# EAGLE schematic ATmega128RFA1-DevBoard (EAGLE 7.5.0)
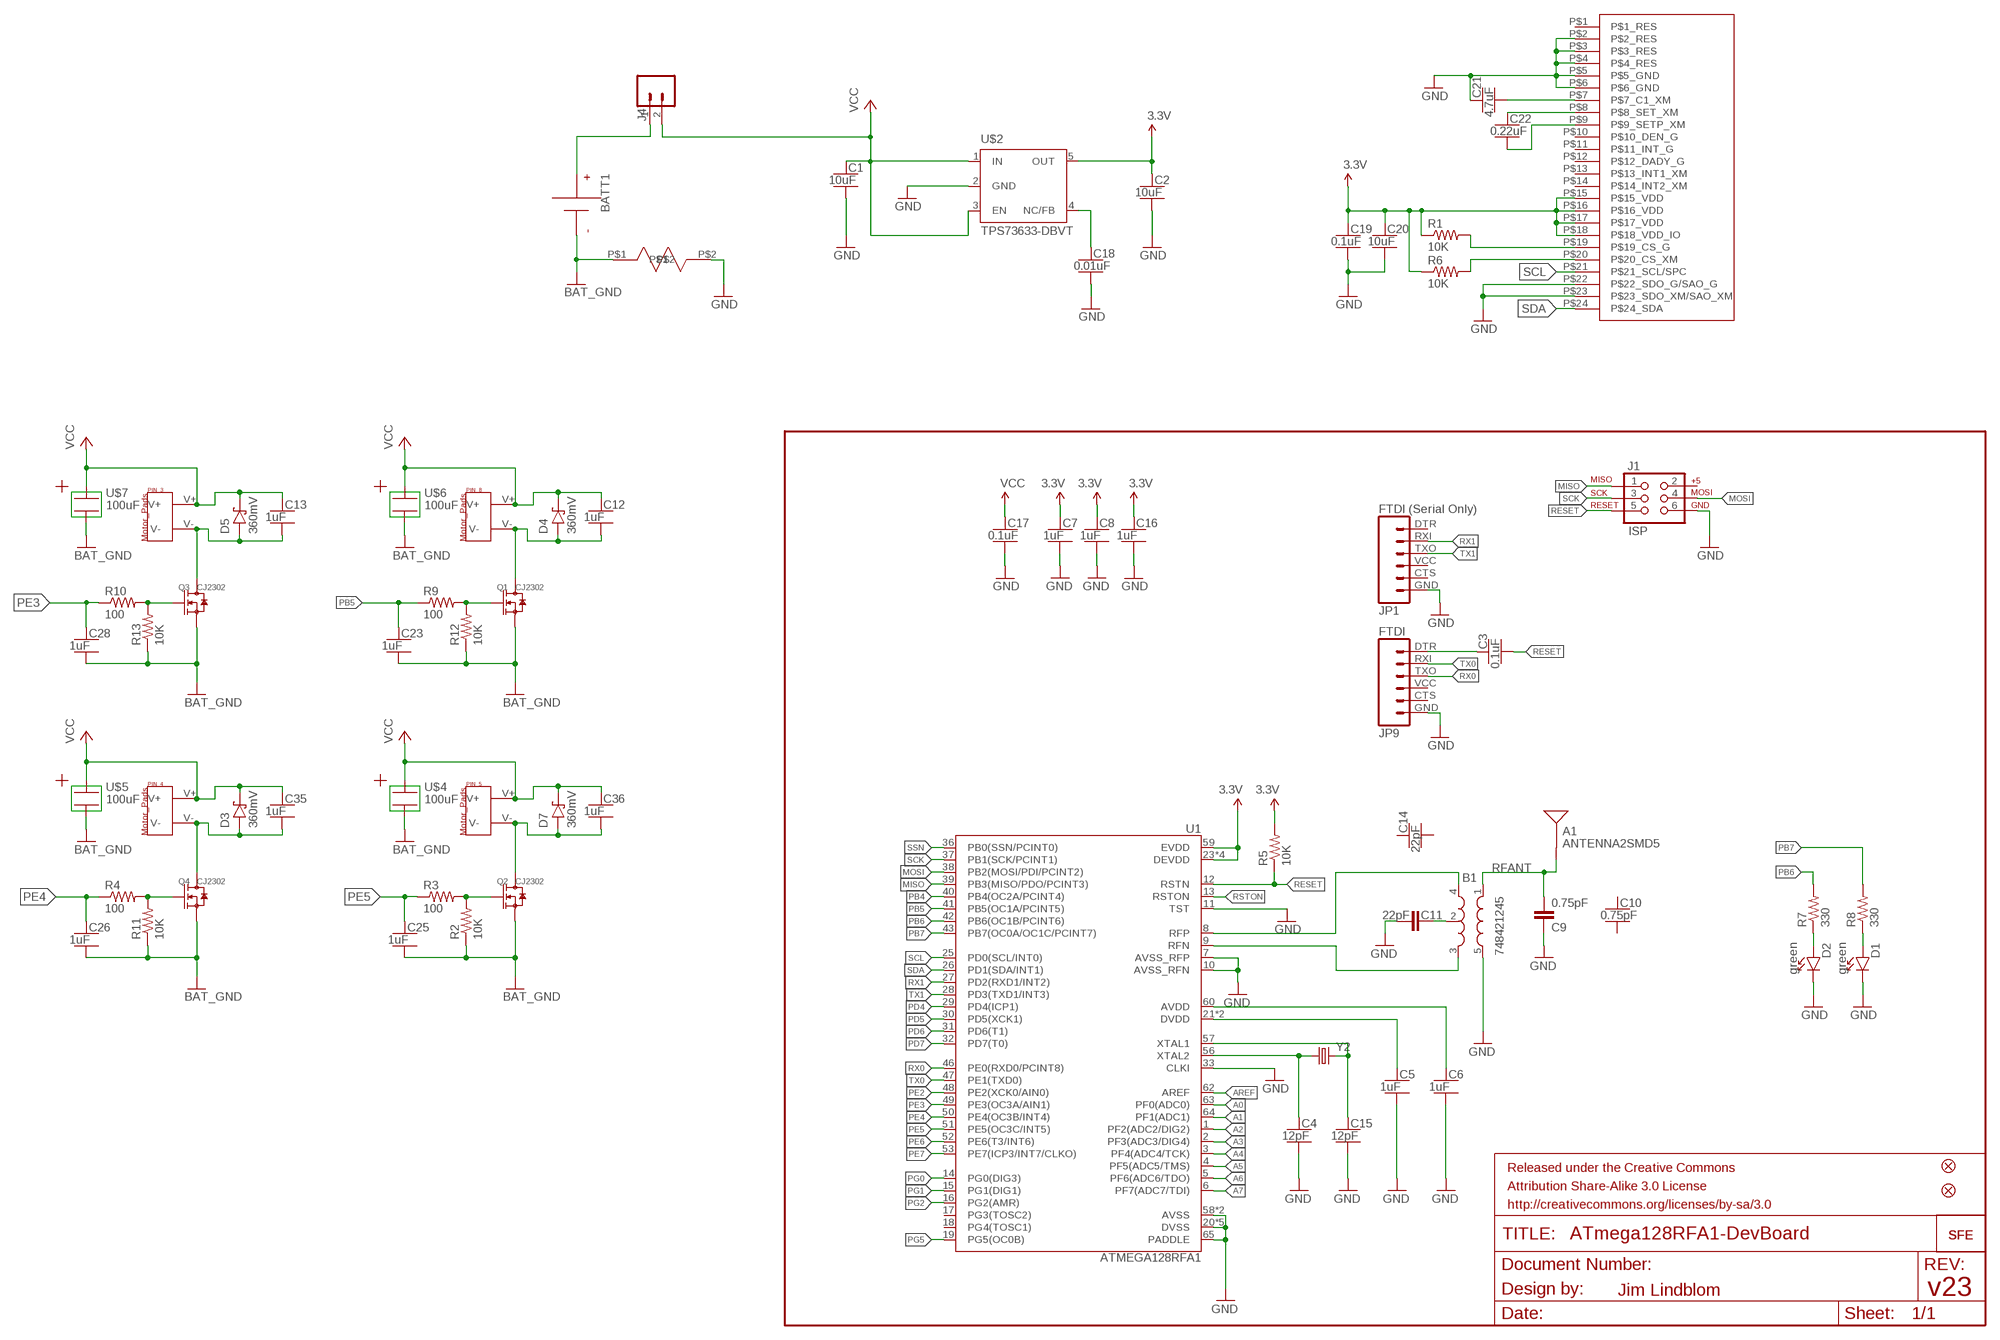
[diagram p0: schematic, sheet 1]

## Parts
A1  ANTENNA2SMD5  [ANTENNA-CHIP5]
B1  748421245  BALUN0805  [BALUN]
BATT1  BATTERY-HUBSAN-W/HOLDER  [BATTERY-W/HOLDER-380MAH-HUBSAN]
C1  10uF  CAPACITOR-NP_SMD-2012-0805_CERAMIC-10UF  [CAPC2012X140_HS]
C2  10uF  CAPACITOR-NP_SMD-2012-0805_CERAMIC-10UF  [CAPC2012X140_HS]
C3  0.1uF  CAPACITOR-NP_SMD-2012-0805_CERAMIC-0.1UF  [CAPC2012X140_HS]
C4  12pF  CAPACITOR-NP_SMD-2012-0805_CERAMIC-12PF  [CAPC2012X140_HS]
C5  1uF  CAPACITOR-NP_SMD-2012-0805_CERAMIC-1UF  [CAPC2012X140_HS]
C6  1uF  CAPACITOR-NP_SMD-2012-0805_CERAMIC-1UF  [CAPC2012X140_HS]
C7  1uF  CAPACITOR-NP_SMD-2012-0805_CERAMIC-1UF  [CAPC2012X140_HS]
C8  1uF  CAPACITOR-NP_SMD-2012-0805_CERAMIC-1UF  [CAPC2012X140_HS]
C9  0.75pF  CAP0402-CAP  [0402-CAP]
C10  0.75pF  CAPACITOR-NP_SMD-2012-0805_CERAMIC-0.75PF  [CAPC2012X140_HS]
C11  22pF  CAP0402-CAP  [0402-CAP]
C12  1uF  CAPACITOR-NP_SMD-2012-0805_CERAMIC-1UF  [CAPC2012X140_HS]
C13  1uF  CAPACITOR-NP_SMD-2012-0805_CERAMIC-1UF  [CAPC2012X140_HS]
C14  22pF  CAPACITOR-NP_SMD-2012-0805_CERAMIC-22PF  [CAPC2012X140_HS]
C15  12pF  CAPACITOR-NP_SMD-2012-0805_CERAMIC-12PF  [CAPC2012X140_HS]
C16  1uF  CAPACITOR-NP_SMD-2012-0805_CERAMIC-1UF  [CAPC2012X140_HS]
C17  0.1uF  CAPACITOR-NP_SMD-2012-0805_CERAMIC-0.1UF  [CAPC2012X140_HS]
C18  0.01uF  CAPACITOR-NP_SMD-2012-0805_CERAMIC-0.01UF  [CAPC2012X140_HS]
C19  0.1uF  CAPACITOR-NP_SMD-2012-0805_CERAMIC-0.1UF  [CAPC2012X140_HS]
C20  10uF  CAPACITOR-NP_SMD-2012-0805_CERAMIC-10UF  [CAPC2012X140_HS]
C21  4.7uF  CAPACITOR-NP_SMD-2012-0805_CERAMIC-4.7UF  [CAPC2012X140_HS]
C22  0.22uF  CAPACITOR-NP_SMD-2012-0805_CERAMIC-0.22UF  [CAPC2012X140_HS]
C23  1uF  CAPACITOR-NP_SMD-2012-0805_CERAMIC-1UF  [CAPC2012X140_HS]
C25  1uF  CAPACITOR-NP_SMD-2012-0805_CERAMIC-1UF  [CAPC2012X140_HS]
C26  1uF  CAPACITOR-NP_SMD-2012-0805_CERAMIC-1UF  [CAPC2012X140_HS]
C28  1uF  CAPACITOR-NP_SMD-2012-0805_CERAMIC-1UF  [CAPC2012X140_HS]
C35  1uF  CAPACITOR-NP_SMD-2012-0805_CERAMIC-1UF  [CAPC2012X140_HS]
C36  1uF  CAPACITOR-NP_SMD-2012-0805_CERAMIC-1UF  [CAPC2012X140_HS]
D1  green  DIODE-LED_SMD-2012-0805-GREEN  [LEDSC125X200X120-2_HS]
D2  green  DIODE-LED_SMD-2012-0805-GREEN  [LEDSC125X200X120-2_HS]
D3  360mV  DIODE-SCHOTTKY_SMD-SOD123-360MV  [SOD3716X135_HS]
D4  360mV  DIODE-SCHOTTKY_SMD-SOD123-360MV  [SOD3716X135_HS]
D5  360mV  DIODE-SCHOTTKY_SMD-SOD123-360MV  [SOD3716X135_HS]
D7  360mV  DIODE-SCHOTTKY_SMD-SOD123-360MV  [SOD3716X135_HS]
FID1  FIDUCIALUFIDUCIAL  [MICRO-FIDUCIAL]
FID2  FIDUCIALUFIDUCIAL  [MICRO-FIDUCIAL]
J1  ISP  AVR_SPI_PRG_6NS  [2X3-NS]
J4  MALE_HEADER_2POS-2X1-0.1IN  [MALE_HEADER_2X1_0.1IN]
JP1  FTDI (Serial Only)  FTDI_BASICPTH  [FTDI_BASIC]
JP4  LOGO-SFENEW  [SFE-NEW-WEBLOGO]
JP9  FTDI  FTDI_BASICPTH  [FTDI_BASIC]
JP10  LOGO-SFENEW  [SFE-NEW-WEBLOGO]
PIN_3  MOTOR_PADS  [MOTOR_PADS]
PIN_4  MOTOR_PADS  [MOTOR_PADS]
PIN_5  MOTOR_PADS  [MOTOR_PADS]
PIN_8  MOTOR_PADS  [MOTOR_PADS]
Q1  CJ2302  SMD-MOSFET-N-CH-20V-2.1A-CJ2302(SOT-23)  [SOT-23]
Q2  CJ2302  SMD-MOSFET-N-CH-20V-2.1A-CJ2302(SOT-23)  [SOT-23]
Q3  CJ2302  SMD-MOSFET-N-CH-20V-2.1A-CJ2302(SOT-23)  [SOT-23]
Q4  CJ2302  SMD-MOSFET-N-CH-20V-2.1A-CJ2302(SOT-23)  [SOT-23]
R1  10K  RESISTOR_SMD-2012-0805-10K  [RESC2012X60_HS]
R2  10K  RESISTOR_SMD-2012-0805-10K  [RESC2012X60_HS]
R3  100  RESISTOR_SMD-2012-0805-100  [RESC2012X60_HS]
R4  100  RESISTOR_SMD-2012-0805-100  [RESC2012X60_HS]
R5  10K  RESISTOR_SMD-2012-0805-10K  [RESC2012X60_HS]
R6  10K  RESISTOR_SMD-2012-0805-10K  [RESC2012X60_HS]
R7  330  RESISTOR_SMD-2012-0805-330  [RESC2012X60_HS]
R8  330  RESISTOR_SMD-2012-0805-330  [RESC2012X60_HS]
R9  100  RESISTOR_SMD-2012-0805-100  [RESC2012X60_HS]
R10  100  RESISTOR_SMD-2012-0805-100  [RESC2012X60_HS]
R11  10K  RESISTOR_SMD-2012-0805-10K  [RESC2012X60_HS]
R12  10K  RESISTOR_SMD-2012-0805-10K  [RESC2012X60_HS]
R13  10K  RESISTOR_SMD-2012-0805-10K  [RESC2012X60_HS]
U1  ATMEGA128RFA1  [QFN-64]
U$1  IMU  [LGA-24_4X4MM]
U$2  TPS73633-DBVT  [SOT23-DBV]
U$3  0  RESISTOR  [SMD_RESISTOR]
U$4  100uF  POLAR_CAP  [TAJB_SMB_POLAR_CAP]
U$5  100uF  POLAR_CAP  [TAJB_SMB_POLAR_CAP]
U$6  100uF  POLAR_CAP  [TAJB_SMB_POLAR_CAP]
U$7  100uF  POLAR_CAP  [TAJB_SMB_POLAR_CAP]
Y2  CRYSTAL5X3  [CRYSTAL-SMD-5X3]

## Nets
3.3V: C2.1 C7.1 C8.1 C16.1 C19.1 C20.1 R1.1 R5.2 R6.1 U1.23(DEVDD) U1.34(DEVDD) U1.44(DEVDD) U1.54(DEVDD) U1.59(EVDD) U$1.P$15(P$15_VDD) U$1.P$16(P$16_VDD) U$1.P$17(P$17_VDD) U$1.P$18(P$18_VDD_IO) U$2.5(OUT)
A0: U1.63(PF0(ADC0))
A1: U1.64(PF1(ADC1))
A2: U1.1(PF2(ADC2/DIG2))
A3: U1.2(PF3(ADC3/DIG4))
A4: U1.3(PF4(ADC4/TCK))
A5: U1.4(PF5(ADC5/TMS))
A6: U1.5(PF6(ADC6/TDO))
A7: U1.6(PF7(ADC7/TDI))
AREF: U1.62(AREF)
AVDD: C6.1 U1.60(AVDD)
BAT_GND: BATT1.-(N) C23.2 C25.2 C26.2 C28.2 Q1.2(S) Q2.2(S) Q3.2(S) Q4.2(S) R2.1 R11.1 R12.1 R13.1 U$3.P$1 U$4.P$2 U$5.P$2 U$6.P$2 U$7.P$2
DTR: C3.1 JP9.DTR
DVDD: C5.1 U1.21(DVDD) U1.22(DVDD)
GND: B1.5(GND) C1.2 C2.2 C4.2 C5.2 C6.2 C7.2 C8.2 C9.1 C11.2 C15.2 C16.2 C17.2 C18.2 C19.2 C20.2 C21.1 D1.C D2.C J1.6 JP1.GND JP9.GND U1.7(AVSS_RFP) U1.10(AVSS_RFN) U1.11(TST) U1.20(DVSS) U1.24(DVSS) U1.33(CLKI) U1.35(DVSS) U1.45(DVSS) U1.55(DVSS) U1.58(AVSS) U1.61(AVSS) U1.65(PADDLE) U$1.P$2(P$2_RES) U$1.P$3(P$3_RES) U$1.P$4(P$4_RES) U$1.P$5(P$5_GND) U$1.P$6(P$6_GND) U$1.P$22(P$22_SDO_G/SAO_G) U$1.P$23(P$23_SDO_XM/SAO_XM) U$2.2(GND) U$3.P$2
MISO: J1.1 U1.39(PB3(MISO/PDO/PCINT3))
MOSI: J1.4 U1.38(PB2(MOSI/PDI/PCINT2))
N$3: C15.1 U1.57(XTAL1) Y2.3
N$4: C4.1 U1.56(XTAL2) Y2.1
N$5: C18.1 U$2.4(NC/FB)
N$6: C21.2 U$1.P$7(P$7_C1_XM)
N$7: B1.2(GND) C11.1
N$8: D2.A R7.1
N$12: C22.1 U$1.P$8(P$8_SET_XM)
N$13: D1.A R8.1
N$14: C22.2 U$1.P$9(P$9_SETP_XM)
N$15: R1.2 U$1.P$19(P$19_CS_G)
N$16: R6.2 U$1.P$20(P$20_CS_XM)
N$17: BATT1.+(P) J4.1
N$18: Q1.1(G) R9.2 R12.2
N$19 [HighAmps]: C12.2 D4.A PIN_8.V- Q1.3(D)
N$21: Q2.1(G) R2.2 R3.2
N$22 [HighAmps]: C36.2 D7.A PIN_5.V- Q2.3(D)
N$24: Q3.1(G) R10.2 R13.2
N$25 [HighAmps]: C13.2 D5.A PIN_3.V- Q3.3(D)
N$27: Q4.1(G) R4.2 R11.2
N$28 [HighAmps]: C35.2 D3.A PIN_4.V- Q4.3(D)
PB4: U1.40(PB4(OC2A/PCINT4))
PB5: C23.1 R9.1 U1.41(PB5(OC1A/PCINT5))
PB6: R7.2 U1.42(PB6(OC1B/PCINT6))
PB7: R8.2 U1.43(PB7(OC0A/OC1C/PCINT7))
PD4: U1.29(PD4(ICP1))
PD5: U1.30(PD5(XCK1))
PD6: U1.31(PD6(T1))
PD7: U1.32(PD7(T0))
PE2: U1.48(PE2(XCK0/AIN0))
PE3: C28.1 R10.1 U1.49(PE3(OC3A/AIN1))
PE4: C26.1 R4.1 U1.50(PE4(OC3B/INT4))
PE5: C25.1 R3.1 U1.51(PE5(OC3C/INT5))
PE6: U1.52(PE6(T3/INT6))
PE7: U1.53(PE7(ICP3/INT7/CLKO))
PG0: U1.14(PG0(DIG3))
PG1: U1.15(PG1(DIG1))
PG2: U1.16(PG2(AMR))
PG5: U1.19(PG5(OC0B))
RESET: C3.2 J1.5 R5.1 U1.12(RSTN)
RFANT: A1.FEED(SIGNAL) B1.1(IN) C9.2
RFN: B1.3(OUT2) U1.9(RFN)
RFP: B1.4(OUT1) U1.8(RFP)
RSTON: U1.13(RSTON)
RX0: JP9.TXO U1.46(PE0(RXD0/PCINT8))
RX1: JP1.RXI U1.27(PD2(RXD1/INT2))
SCK: J1.3 U1.37(PB1(SCK/PCINT1))
SCL: U1.25(PD0(SCL/INT0)) U$1.P$21(P$21_SCL/SPC)
SDA: U1.26(PD1(SDA/INT1)) U$1.P$24(P$24_SDA)
SSN: U1.36(PB0(SSN/PCINT0))
TX0: JP9.RXI U1.47(PE1(TXD0))
TX1: JP1.TXO U1.28(PD3(TXD1/INT3))
VCC: C1.1 C12.1 C13.1 C17.1 C35.1 C36.1 D3.C D4.C D5.C D7.C J4.2 PIN_3.V+ PIN_4.V+ PIN_5.V+ PIN_8.V+ U$2.1(IN) U$2.3(EN) U$4.P$1 U$5.P$1 U$6.P$1 U$7.P$1
Unconnected: C10.1 C10.2 C14.1 C14.2 J1.2 JP1.CTS JP1.DTR JP1.VCC JP9.CTS JP9.VCC U1.17(PG3(TOSC2)) U1.18(PG4(TOSC1)) U$1.P$1(P$1_RES) U$1.P$10(P$10_DEN_G) U$1.P$11(P$11_INT_G) U$1.P$12(P$12_DADY_G) U$1.P$13(P$13_INT1_XM) U$1.P$14(P$14_INT2_XM)

## Notes on the sheet
- Jim Lindblom | v23

## Library data of the parts
A1 = SparkFun-RF:ANTENNA2: Chip antenna Single endded antenna. Common with smaller chip antennas. CHIP4 package is the GPS Chip Antenna SKU: GPS-08418. CHIP5 package is 2.4GHz chip antenna SKU: WRL-00144.
B1 = SparkFun-RF:BALUN: 0805 footprint balun- Ember 351/357
BATT1 = quadparts_prebuilt:BATTERY
C1 C2 C20 = quadparts_prebuilt:CAPACITOR-NP_: Nonpolarized capacitor; DIST: Digikey; DISTPN: 490-5523-1-ND; MFR: Murata Electronics North America; MPN: GRM21BR61E106KA73L
C3 C17 C19 = quadparts_prebuilt:CAPACITOR-NP_: Nonpolarized capacitor; DIST: Digikey; DISTPN: 490-1666-1-ND; MFR: Murata Electronics North America; MPN: GRM21BR71H104KA01L
C4 C15 = quadparts_prebuilt:CAPACITOR-NP_: Nonpolarized capacitor; DIST: Digikey; DISTPN: 490-5531-1-ND; MFR: Murata Electronics North America; MPN: GRM21A5C2E120JW01D
C5-C8 C12 C13 C16 C23 C25 C26 C28 C35 C36 = quadparts_prebuilt:CAPACITOR-NP_: Nonpolarized capacitor; DIST: Digikey; DISTPN: 490-4736-1-ND; MFR: Murata Electronics North America; MPN: GRM21BR71H105KA12L
C9 C11 = SparkFun-Passives:CAP: Capacitor Standard 0603 ceramic capacitor, and 0.1" leaded capacitor.
C10 = quadparts_prebuilt:CAPACITOR-NP_: Nonpolarized capacitor; DIST: Digikey; DISTPN: 490-3585-1-ND; MFR: Murata Electronics North America; MPN: GQM2195C2AR75CB01D
C14 = quadparts_prebuilt:CAPACITOR-NP_: Nonpolarized capacitor; DIST: Digikey; DISTPN: 490-5534-1-ND; MFR: Murata Electronics North America; MPN: GRM21A5C2E220JW01D
C18 = quadparts_prebuilt:CAPACITOR-NP_: Nonpolarized capacitor; DIST: Digikey; DISTPN: 490-8295-1-ND; MFR: Murata Electronics North America; MPN: GRM2195C1H103FA01D
C21 = quadparts_prebuilt:CAPACITOR-NP_: Nonpolarized capacitor; DIST: Digikey; DISTPN: 490-3335-1-ND; MFR: Murata Electronics North America; MPN: GRM21BR61E475KA12L
C22 = quadparts_prebuilt:CAPACITOR-NP_: Nonpolarized capacitor; DIST: Digikey; DISTPN: 490-1670-1-ND; MFR: Murata Electronics North America; MPN: GRM21BR71H224KA01L
D1 D2 = quadparts_prebuilt:DIODE-LED_: Light emitting diode; DIST: Digikey; DISTPN: 160-1179-1-ND; MFR: Lite-On Inc; MPN: LTST-C170GKT
D3-D5 D7 = quadparts_prebuilt:DIODE-SCHOTTKY_: Schottky diode; DIST: Digikey; DISTPN: CRS08QMCT-ND; MFR: Toshiba Semiconductor and Storage; MPN: CRS08(TE85L,Q,M)
FID1 FID2 = SparkFun-Aesthetics:FIDUCIAL: Fiducial Alignment Points Various fiducial points for machine vision alignment.
J1 = SparkFun-Connectors:AVR_SPI_PRG_6: AVR ISP 6 Pin This is the reduced ISP connector for AVR programming. Common on Arduino. This footprint will take up less PCB space and can be used with a 10-pin to 6-pin adapter such as SKU: BOB-08508
J4 = quadparts:MALE_HEADER_2POS: 2 pin single inline pin header, socket, or connector; CREATOR: SWANSON; DIST: Digikey; DISTPN: 3M9447-ND; MFR: 3M; MPN: 961102-6404-AR
JP1 JP9 = SparkFun-Connectors:FTDI_BASIC: FTDI Basic header with labels
JP4 JP10 = SparkFun-Aesthetics:LOGO-SFE: Spark Fun Electronics PCB Logo This is the standard Spark Fun Electronics PCB logo.
PIN_3-PIN_5 PIN_8 = Andranik-Lab4:MOTOR_PADS
Q1-Q4 = Seeed-Transistor-2016:SMD-MOSFET-N-CH-20V-2.1A-CJ2302(SOT-23): 305030015; MPN: CJ2302
R1 R2 R5 R6 R11-R13 = quadparts_prebuilt:RESISTOR_: Resistor; DIST: Digikey; DISTPN: 311-10KARCT-ND; MFR: Yageo; MPN: RC0805JR-0710KL
R3 R4 R9 R10 = quadparts_prebuilt:RESISTOR_: Resistor; DIST: Digikey; DISTPN: 311-100ARCT-ND; MFR: Yageo; MPN: RC0805JR-07100RL
R7 R8 = quadparts_prebuilt:RESISTOR_: Resistor; DIST: Digikey; DISTPN: 311-330ARCT-ND; MFR: Yageo; MPN: RC0805JR-07330RL
U1 = SparkFun-DigitalIC:ATMEGA128RFA1: ATmega128RFA1 8-bit AVR Microcontroller with Low Power 2.4GHz Transceiver for ZigBee and IEEE 802.15.4
U$1 = quadparts:IMU; DIST: DIGIKEY; DISTPN: 497-13902-1-ND; MFP: LSM9DS0TR; MFR: STMicroelectronics
U$2 = quadparts_prebuilt:TPS73633-DBVT; DATASHEET: http://www.ti.com/lit/ds/symlink/lp3985.pdf; DIST: Digikey; DISTPN: LP3985IM5X-3.0/NOPBCT-ND; MFR: Texas Instruments; MPN: LP3985IM5X-3.0/NOPB; PRICE: 0.59
U$3 = quadparts:RESISTOR; DIST: DIGIKEY; DISTPN: 311-0.0ARCT-ND; MFR: Yageo; MPN: RC0805JR-070RL
U$4-U$7 = quadparts:POLAR_CAP; DIST: DIGIKEY; DISTPN: 478-1677-1-ND; MFR: AVX Corporation; MPN: TAJB107K006RNJ
Y2 = quadparts_prebuilt:CRYSTAL: Various standard crystals. Proven footprints.; DATASHEET: http://www.abracon.com/Resonators/abm3b.pdf; DIST: Digikey; DISTPN: 535-9122-1-ND; MFR: Abracon LLC; MPN: ABM3B-16.000MHZ-B2-T; PRICE: 0.68; PROD_ID: XTAL-08218

## Net classes
1 HighAmps: width 0.762 mm